# EAGLE design rev_a (EAGLE 7.7.0)
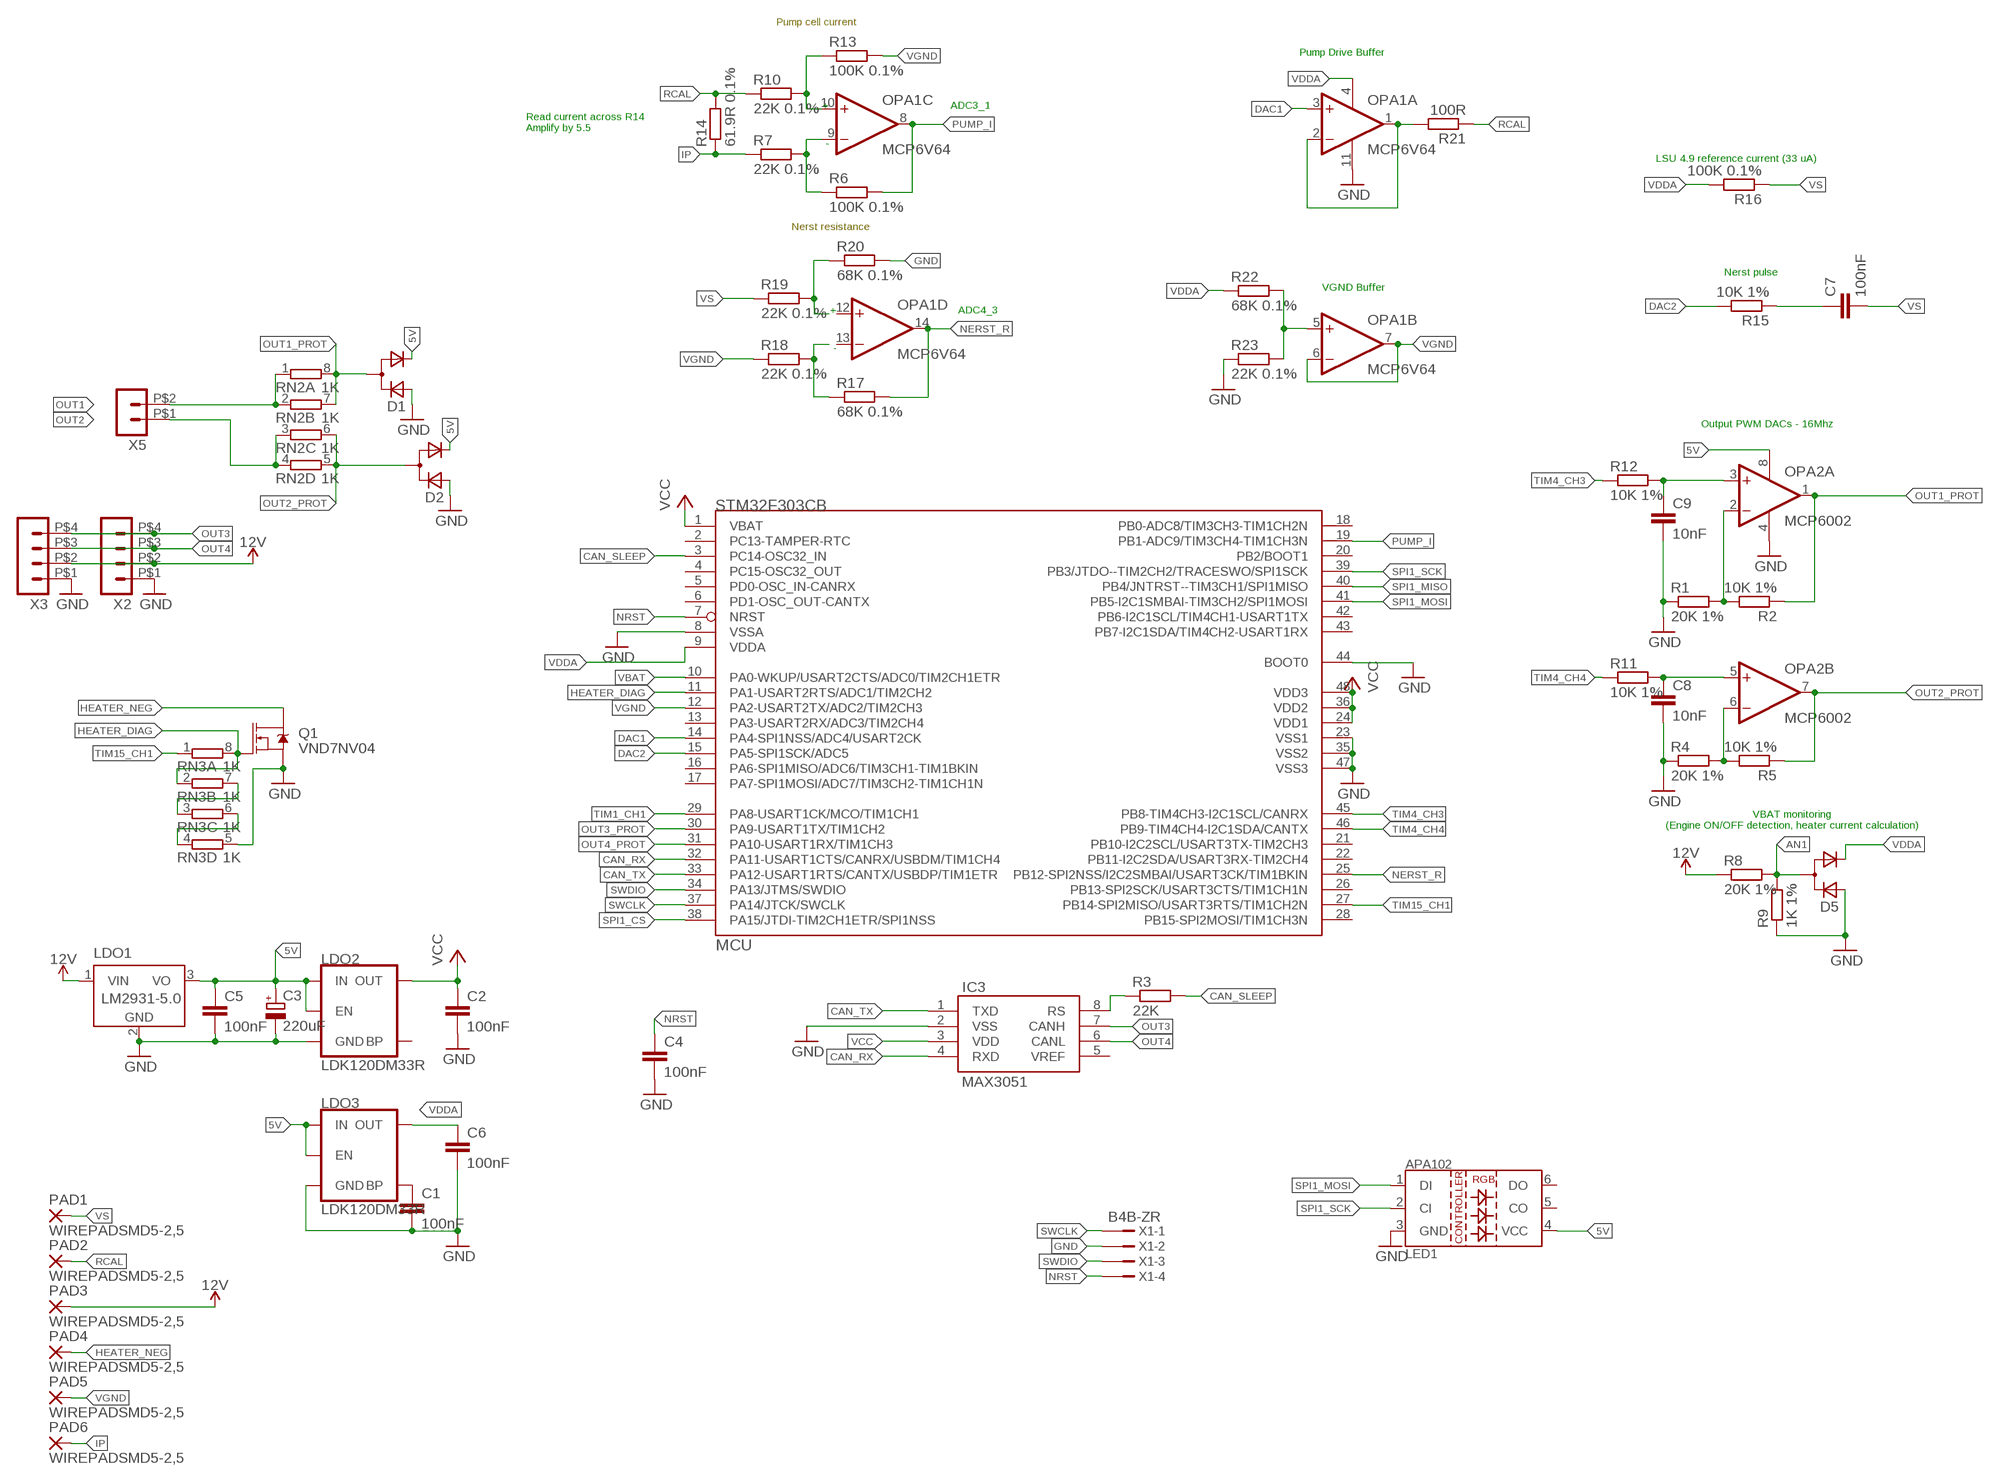
[diagram p0: schematic, sheet 1]

## Parts
C1  100nF  C-EUC0603  [C0603]
C2  100nF  C-EUC0603  [C0603]
C3  220uF  CPOL-EUE2.5-5  [E2,5-5]
C4  100nF  C-EUC0603  [C0603]
C5  100nF  C-EUC0603  [C0603]
C6  100nF  C-EUC0603  [C0603]
C7  100nF  C-EUC0603  [C0603]
C8  10nF  C-EUC0603  [C0603]
C9  10nF  C-EUC0603  [C0603]
D1  D_ACACSOT323  [SOT323]
D2  D_ACACSOT323  [SOT323]
D5  D_ACACSOT323  [SOT323]
IC3  MAX3051  MCP2551  [SO08]
LDO1  LM2931-5.0  LM2936DT-5.0  [TO252]
LDO2  LDK120DM33R  V_REG_MIC52053.3V  [SOT23-5]
LDO3  LDK120DM33R  V_REG_MIC52053.3V  [SOT23-5]
LED1  LED-APA102  [LED-APA102]
MCU  STM32F303CB  STM32-M-48  [LQFP48]
OPA1  MCP6V64  MCP604ST  [TSSOP14]
OPA2  MCP6002  MCP602ST  [TSSOP8]
PAD1  WIREPADSMD5-2,5  [5-2,5]
PAD2  WIREPADSMD5-2,5  [5-2,5]
PAD3  WIREPADSMD5-2,5  [5-2,5]
PAD4  WIREPADSMD5-2,5  [5-2,5]
PAD5  WIREPADSMD5-2,5  [5-2,5]
PAD6  WIREPADSMD5-2,5  [5-2,5]
Q1  VND7NV04  MOSFET-NCH-FDD8780  [DPAK]
R1  20K 1%  R-EU_R0603  [R0603]
R2  10K 1%  R-EU_R0603  [R0603]
R3  22K  R-EU_R0603  [R0603]
R4  20K 1%  R-EU_R0603  [R0603]
R5  10K 1%  R-EU_R0603  [R0603]
R6  100K 0.1%  R-EU_R0603  [R0603]
R7  22K 0.1%  R-EU_R0603  [R0603]
R8  20K 1%  R-EU_R0603  [R0603]
R9  1K 1%  R-EU_R0603  [R0603]
R10  22K 0.1%  R-EU_R0603  [R0603]
R11  10K 1%  R-EU_R0603  [R0603]
R12  10K 1%  R-EU_R0603  [R0603]
R13  100K 0.1%  R-EU_R0603  [R0603]
R14  61.9R 0.1%  R-EU_R0603  [R0603]
R15  10K 1%  R-EU_R0603  [R0603]
R16  100K 0.1%  R-EU_R0603  [R0603]
R17  68K 0.1%  R-EU_R0603  [R0603]
R18  22K 0.1%  R-EU_R0603  [R0603]
R19  22K 0.1%  R-EU_R0603  [R0603]
R20  68K 0.1%  R-EU_R0603  [R0603]
R21  100R  R-EU_R0603  [R0603]
R22  68K 0.1%  R-EU_R0603  [R0603]
R23  22K 0.1%  R-EU_R0603  [R0603]
RN2  1K  4R-N0603-ARC  [0603-ARC]
RN3  1K  4R-N0603-ARC  [0603-ARC]
X1  B4B-ZR  [B4B-ZR]
X2  HEADER_POS4_43045-0401  [43045-0400]
X3  HEADER_POS4_43045-0401  [43045-0400]
X5  HEADER_POS2_43045-0200  [43045-0200]

## Nets
5V: C3.+ C5.1 D1.2(C) D2.2(C) LDO1.3(VO) LDO2.1(IN) LDO2.3(EN) LDO3.1(IN) LDO3.3(EN) LED1.4(VCC) OPA2.8(P:V+)
12V: LDO1.1(VIN) PAD3.1(P) R8.1 X2.P$2 X3.P$2
AN1: D5.1(CA) R8.2 R9.2
CAN_RX: IC3.4(RXD) MCU.32(PA11-USART1CTS/CANRX/USBDM/TIM1CH4)
CAN_SLEEP: MCU.3(PC14-OSC32_IN) R3.2
CAN_TX: IC3.1(TXD) MCU.33(PA12-USART1RTS/CANTX/USBDP/TIM1ETR)
DAC1: MCU.14(PA4-SPI1NSS/ADC4/USART2CK) OPA1.3(A:+IN)
DAC2: MCU.15(PA5-SPI1SCK/ADC5) R15.2
GND: C1.2 C2.2 C3.- C4.2 C5.2 C6.2 C8.2 C9.2 D1.3(A) D2.3(A) D5.3(A) IC3.2(VSS) LDO1.2(GND) LDO2.2(GND) LDO3.2(GND) LED1.3(GND) MCU.23(VSS1) MCU.35(VSS2) MCU.44(BOOT0) MCU.47(VSS3) OPA1.11(P:V-) OPA2.4(P:V-) Q1.3(S) R1.1 R4.1 R9.1 R20.2 R23.1 RN3.5 X1.2 X2.P$1 X3.P$1
HEATER_DIAG: MCU.11(PA1-USART2RTS/ADC1/TIM2CH2) Q1.1(G) RN3.2 RN3.8
HEATER_NEG: PAD4.1(P) Q1.4(D)
IP: PAD6.1(P) R7.1 R14.1
N$2: RN3.3 RN3.7
N$4: C8.1 OPA2.5(B:+IN) R11.2
N$5: OPA2.2(A:-IN) R1.2 R2.2
N$6: OPA2.6(B:-IN) R4.2 R5.2
N$7: RN3.4 RN3.6
N$8: IC3.8(RS) R3.1
N$10: OPA1.5(B:+IN) R22.2 R23.2
N$11: C1.1 LDO3.4(BP)
N$12: C7.1 R15.1
N$13: C9.1 OPA2.3(A:+IN) R12.2
N$15: OPA1.1(A:OUT) OPA1.2(A:-IN) R21.2
NERST_R: MCU.25(PB12-SPI2NSS/I2C2SMBAI/USART3CK/TIM1BKIN) OPA1.14(D:OUT) R17.2
NRST: C4.1 MCU.7(NRST) X1.4
OPA3_IN+: OPA1.10(C:+IN) R10.2 R13.1
OPA3_IN-: OPA1.9(C:-IN) R6.1 R7.2
OPA4_IN+: R19.2 R20.1
OPA4_IN-: R17.1 R18.2
OUT1: RN2.1 RN2.2 X5.P$2
OUT1_PROT: D1.1(CA) OPA2.1(A:OUT) R2.1 RN2.7 RN2.8
OUT2: RN2.3 RN2.4 X5.P$1
OUT2_PROT: D2.1(CA) OPA2.7(B:OUT) R5.1 RN2.5 RN2.6
OUT3: IC3.7(CANH) X2.P$4 X3.P$4
OUT3_PROT: MCU.30(PA9-USART1TX/TIM1CH2)
OUT4: IC3.6(CANL) X2.P$3 X3.P$3
OUT4_PROT: MCU.31(PA10-USART1RX/TIM1CH3)
PUMP_I: MCU.19(PB1-ADC9/TIM3CH4-TIM1CH3N) OPA1.8(C:OUT) R6.2
RCAL: PAD2.1(P) R10.1 R14.2 R21.1
SPI1_CS: MCU.38(PA15/JTDI-TIM2CH1ETR/SPI1NSS)
SPI1_MISO: MCU.40(PB4/JNTRST--TIM3CH1/SPI1MISO)
SPI1_MOSI: LED1.1(DI) MCU.41(PB5-I2C1SMBAI-TIM3CH2/SPI1MOSI)
SPI1_SCK: LED1.2(CI) MCU.39(PB3/JTDO--TIM2CH2/TRACESWO/SPI1SCK)
SWCLK: MCU.37(PA14/JTCK/SWCLK) X1.1
SWDIO: MCU.34(PA13/JTMS/SWDIO) X1.3
TIM1_CH1: MCU.29(PA8-USART1CK/MCO/TIM1CH1)
TIM4_CH3: MCU.45(PB8-TIM4CH3-I2C1SCL/CANRX) R12.1
TIM4_CH4: MCU.46(PB9-TIM4CH4-I2C1SDA/CANTX) R11.1
TIM15_CH1: MCU.27(PB14-SPI2MISO/USART3RTS/TIM1CH2N) RN3.1
VBAT: MCU.1(VBAT) MCU.10(PA0-WKUP/USART2CTS/ADC0/TIM2CH1ETR) ; supply symbol labelled VCC
VCC: C2.1 IC3.3(VDD) LDO2.5(OUT) MCU.24(VDD1) MCU.36(VDD2) MCU.48(VDD3)
VDDA: C6.1 D5.2(C) LDO3.5(OUT) MCU.9(VDDA) OPA1.4(P:V+) R16.2
VGND: MCU.12(PA2-USART2TX/ADC2/TIM2CH3) OPA1.6(B:-IN) OPA1.7(B:OUT) PAD5.1(P) R13.2 R18.1
VS: C7.2 PAD1.1(P) R16.1 R19.1
VSSA: MCU.8(VSSA) ; supply symbol labelled GND
Unconnected: IC3.5(VREF) LDO2.4(BP) LED1.5(CO) LED1.6(DO) MCU.2(PC13-TAMPER-RTC) MCU.4(PC15-OSC32_OUT) MCU.5(PD0-OSC_IN-CANRX) MCU.6(PD1-OSC_OUT-CANTX) MCU.13(PA3-USART2RX/ADC3/TIM2CH4) MCU.16(PA6-SPI1MISO/ADC6/TIM3CH1-TIM1BKIN) MCU.17(PA7-SPI1MOSI/ADC7/TIM3CH2-TIM1CH1N) MCU.18(PB0-ADC8/TIM3CH3-TIM1CH2N) MCU.20(PB2/BOOT1) MCU.21(PB10-I2C2SCL/USART3TX-TIM2CH3) MCU.22(PB11-I2C2SDA/USART3RX-TIM2CH4) MCU.26(PB13-SPI2SCK/USART3CTS/TIM1CH1N) MCU.28(PB15-SPI2MOSI/TIM1CH3N) MCU.42(PB6-I2C1SCL/TIM4CH1-USART1TX) MCU.43(PB7-I2C1SDA/TIM4CH2-USART1RX) OPA1.12(D:+IN) OPA1.13(D:-IN) R22.1

## Notes on the sheet
- Pump cell current
- Pump Drive Buffer
- + | ADC3_1
- Read current across R14
  Amplify by 5.5
- -
- LSU 4.9 reference current (33 uA)
- Nerst resistance
- Nerst pulse
- VGND Buffer
- + | ADC4_3
- -
- Output PWM DACs - 16Mhz
- VBAT monitoring
  (Engine ON/OFF detection, heater current calculation)

## Library data of the parts
C1 C2 C4-C9 = resistor:C-EU: CAPACITOR, European symbol
C3 = rcl:CPOL-EU: POLARIZED CAPACITOR, European symbol
D1 D2 D5 = zetex:D_ACAC: Dual DIODE; OC_FARNELL: unknown; OC_NEWARK: unknown
IC3 = SparkFun-IC-Comms:MCP2551: MCP2551 High Speed CAN Transceiver High speed CAN transceiver Datasheet <http://www.sparkfun.com/datasheets/DevTools/Arduino/MCP2551.pdf> SparkFun Products CAN-BUS Shield <https://www.sparkfun.com/products/13262> (DEV-13262) SparkFun OBD-II UART <https://www.sparkfun.com/products/9555> (WIG-09555); PROD_ID: IC-09907; VALUE: MCP2551
LDO1 = national-semiconductor:LM2936?*: Ultra-Low Quiescent Current LDO Voltage Regulator Source: Data sheet <http://www.national.com/ds/LM/LM2936.pdf>; MF: NATIONAL SEMICONDUCTOR; MPN: LM2936DT-5.0/NOPB; OC_FARNELL: 1286864; OC_NEWARK: 41K4501
LDO2 LDO3 = SparkFun-IC-Power:V_REG_MIC5205: V_REG MIC5205 Standard 3.3V, 5V, and Adjustable 150mA LDO voltage regulator in SOT-23 layout. Micrel part MIC5205. BP (by-pass) pin is used to lower output noise with 470pF cap, may be left open. On the adjustable version BP is used to set output.; PROD_ID: VREG-00822; VALUE: 3.3V/150mA
LED1 = Ai_LED:LED-APA102
MCU = pel_stm32:STM32-M-48: STM32F103 Medium Density 48pins
OPA1 = linear:MCP604: Quad Op Amp 2.7V to 6.0V Single Supply CMOS Source: http://ww1.microchip.com/downloads/en/DeviceDoc/21314g.pdf
OPA2 = linear:MCP602: Single Op Amp 2.7V to 6.0V Single Supply CMOS Source: http://ww1.microchip.com/downloads/en/DeviceDoc/21314g.pdf
PAD1-PAD6 = wirepad:WIREPAD: Wire PAD connect wire on PCB
Q1 = SparkFun-DiscreteSemi:MOSFET-NCH: N-channel MOSFETs Voltage controlled devices that allow control of high current outputs. SparkFun Products: SparkFun OpenScale <https://www.sparkfun.com/products/13261> SparkFun Digital Sandbox <https://www.sparkfun.com/products/12651> SparkFun Monster Moto Shield <https://www.sparkfun.com/products/10182> SparkFun MOSFET Power Controller <https://www.sparkfun.com/products/11214>; PROD_ID: TRANS-09984; VALUE: 35A/25V/8.5mΩ
R1-R23 = resistor:R-EU_: RESISTOR, European symbol
RN2 RN3 = resistor-dil:4R-N: Array Chip Resistor Source: RS Component / Phycomp; OC_FARNELL: unknown; OC_NEWARK: unknown
X1 = con-jst:?4B-ZR: ZH CONNECTOR 1.5 mm, 4 pin 1 row Source: http://www.jst.com .. eZH.pdf; MF: FARNELL; MPN: B4B-ZR(LF)(SN); OC_FARNELL: 1830916; OC_NEWARK: 37K9960
X2 X3 = con-molex-micro-fit-3_0:HEADER_POS4_?: Molex - Micro-Fit 3.0 Series connector, 3.00mm (0.118") pitch header, 4 positions.
X5 = con-molex-micro-fit-3_0:HEADER_POS2_?: Molex - Micro-Fit 3.0 Series connector, 3.00mm (0.118") pitch header, 2 positions.

## Board
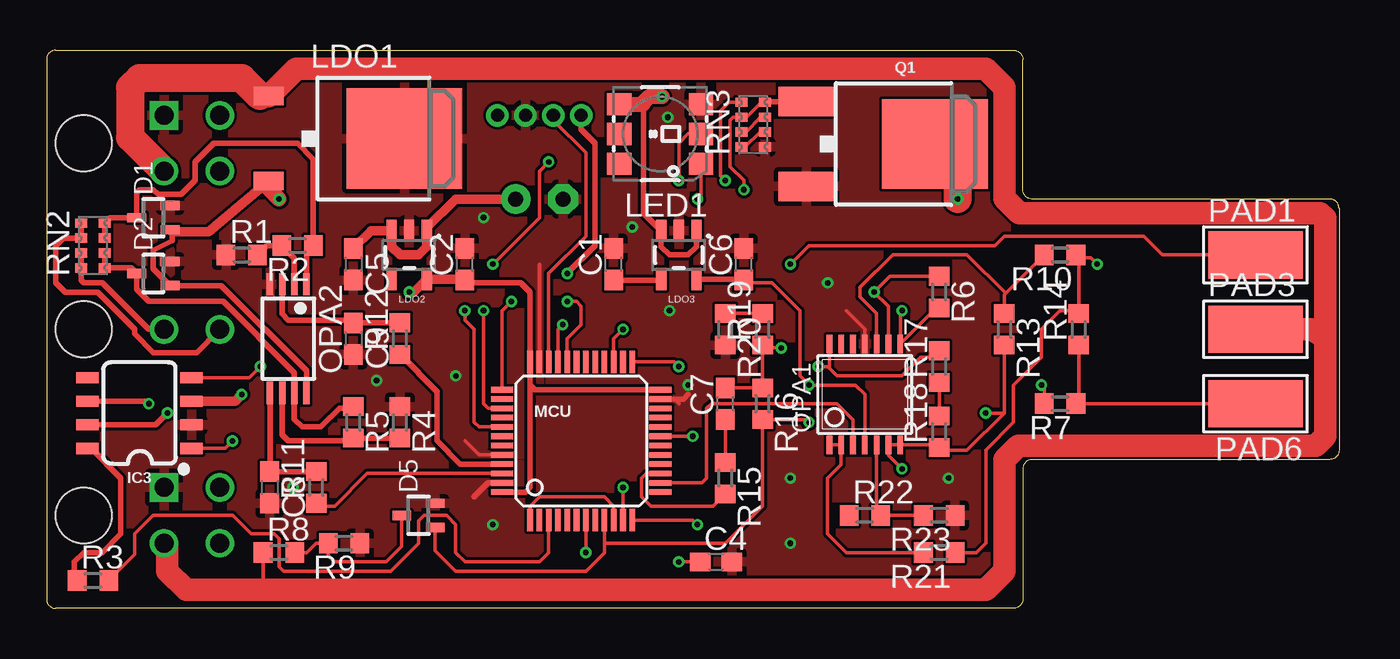
[diagram p1: board, top side]
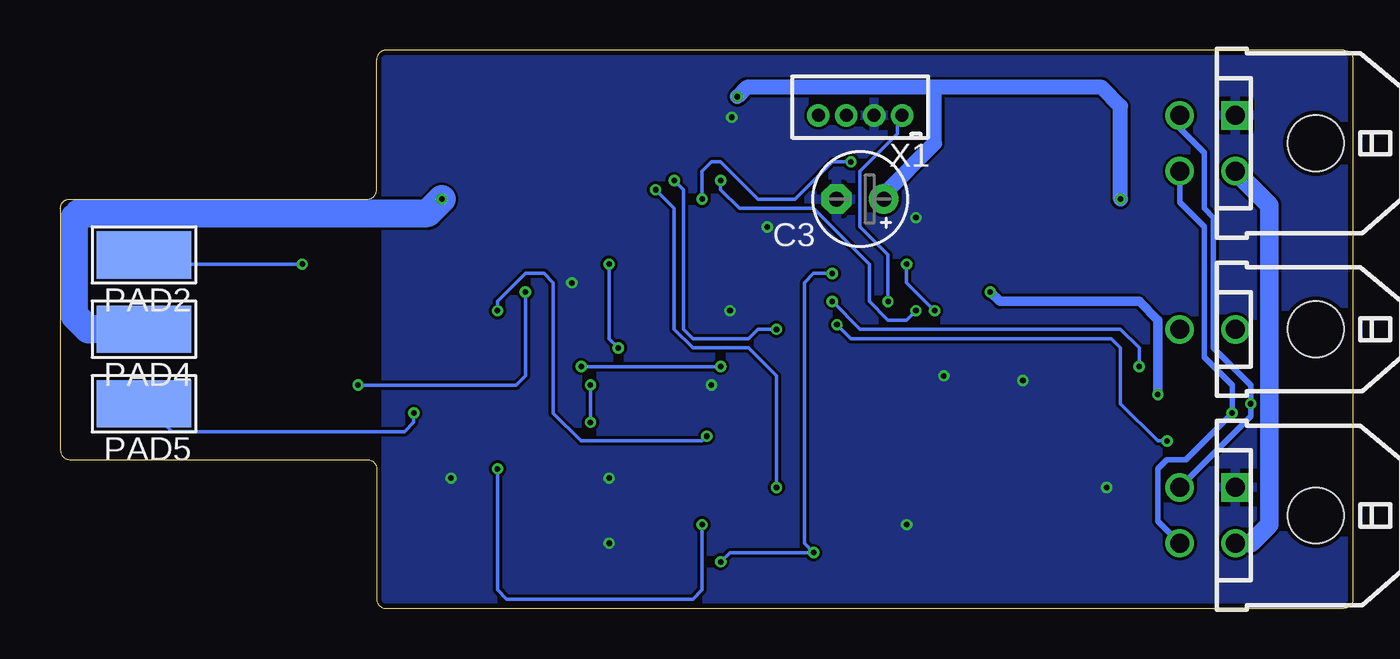
[diagram p2: board, bottom side, seen from below]

Size 69.5 x 30 mm. Coordinates in mm from the lower left corner, seen from the top.
Outline: 0,29.5 0,0.5 arc90 0.5,0 52,0 arc90 52.5,0.5 52.5,7.5 arc-90 53,8 69,8 arc90 69.5,8.5 69.5,21.5 arc90 69,22 53,22 arc-90 52.5,22.5 52.5,29.5 arc90 52,30 0.5,30 arc90 0,29.5
Copper layers (1*16): Top 0.035mm / dielectric 1.5mm / Bottom 0.035mm
Design rules "SeeedStudio_2layer_DRU_no_angle_20140221 *": minimum track width 6mil, minimum drill 0.3mm, track to track 6mil, track to pad 6mil, pad to pad 6mil, via to via 6mil, smd to smd 0mil, copper to edge 10mil, drill to drill 10mil, minimum pad ring 10mil, minimum via ring 6mil, stop-mask expansion 2mil, vias tented up to drill 100mil, thermal gap 10mil

### Footprints (pad centres in the part's own frame; a part is rotated, then mirrored left to right if it is on the bottom)
C0603 = smd 1.1 x 1: 1 -0.85,0; 2 0.85,0
E2,5-5 = drill 0.813 pad 1.6: + -1.27,0 | drill 0.813 pad 1.6 octagon: - 1.27,0
SOT323 = smd 0.5 x 1: 1 0,0.9; 2 -0.65,-0.9; 3 0.65,-0.9
SO08 = smd 0.6 x 1.2: 1 -1.905,-2.8; 2 -0.635,-2.8; 3 0.635,-2.8; 4 1.905,-2.8; 5 1.905,2.8; 6 0.635,2.8; 7 -0.635,2.8; 8 -1.905,2.8
TO252 = smd 1 x 1.6: 1 -2.28,-4.8; 3 2.28,-4.8 | smd 5.4 x 6.2: 2 0,2.5
SOT23-5 = smd 0.55 x 1.2: 1 -0.95,-1.3; 2 0,-1.3; 3 0.95,-1.3; 4 0.95,1.3; 5 -0.95,1.3
LED-APA102 = smd 1.3 x 1.2: 1 -2.2,1.6; 2 -2.2,0; 3 -2.2,-1.6; 4 2.2,-1.6; 5 2.2,0; 6 2.2,1.6
LQFP48 = smd 0.3 x 1.2: 1 -2.75,-4.25; 2 -2.25,-4.25; 3 -1.75,-4.25; 4 -1.25,-4.25; 5 -0.75,-4.25; 6 -0.25,-4.25; 7 0.25,-4.25; 8 0.75,-4.25; 9 1.25,-4.25; 10 1.75,-4.25; 11 2.25,-4.25; 12 2.75,-4.25; 25 2.75,4.25; 26 2.25,4.25; 27 1.75,4.25; 28 1.25,4.25; 29 0.75,4.25; 30 0.25,4.25; 31 -0.25,4.25; 32 -0.75,4.25; 33 -1.25,4.25; 34 -1.75,4.25; 35 -2.25,4.25; 36 -2.75,4.25 | smd 1.2 x 0.3: 13 4.25,-2.75; 14 4.25,-2.25; 15 4.25,-1.75; 16 4.25,-1.25; 17 4.25,-0.75; 18 4.25,-0.25; 19 4.25,0.25; 20 4.25,0.75; 21 4.25,1.25; 22 4.25,1.75; 23 4.25,2.25; 24 4.25,2.75; 37 -4.25,2.75; 38 -4.25,2.25; 39 -4.25,1.75; 40 -4.25,1.25; 41 -4.25,0.75; 42 -4.25,0.25; 43 -4.25,-0.25; 44 -4.25,-0.75; 45 -4.25,-1.25; 46 -4.25,-1.75; 47 -4.25,-2.25; 48 -4.25,-2.75
TSSOP14 = smd 0.305 x 0.991: 1 -1.905,-2.718; 2 -1.27,-2.718; 3 -0.635,-2.718; 4 0,-2.718; 5 0.635,-2.718; 6 1.27,-2.718; 7 1.905,-2.718; 8 1.905,2.718; 9 1.27,2.718; 10 0.635,2.718; 11 0,2.718; 12 -0.635,2.718; 13 -1.27,2.718; 14 -1.905,2.718
TSSOP8 = smd 0.35 x 1.2: 1 -0.975,-2.925; 2 -0.325,-2.925; 3 0.325,-2.925; 4 0.975,-2.925; 5 0.975,2.925; 6 0.325,2.925; 7 -0.325,2.925; 8 -0.975,2.925
5-2,5 = smd 2.54 x 5.08: 1 0,0
DPAK = smd 1.6 x 3: 1 -2.28,-5.31; 3 2.28,-5.31 | smd 4.826 x 5.715: 4 0,1.588
R0603 = smd 1 x 1.1: 1 -0.85,0; 2 0.85,0
0603-ARC = smd 0.5 x 0.65: 1 -1.2,-0.625; 2 -0.4,-0.625; 3 0.4,-0.625; 4 1.2,-0.625; 5 1.2,0.625; 6 0.4,0.625; 7 -0.4,0.625; 8 -1.2,0.625
B4B-ZR = drill 0.7 pad 1.1: 1 -2.25,0; 2 -0.75,0; 3 0.75,0; 4 2.25,0
43045-0400 = drill 1.02 square: P$1 1.5,4.32 | drill 1.02: P$2 -1.5,4.32; P$3 1.5,7.32; P$4 -1.5,7.32 | hole 3: 0,0
43045-0200 = drill 1.02: P$1 0,4.32; P$2 0,7.32 | hole 3: 0,0

### Placement (x,y rotation side)
C1  30.5,18.5 90 top
C2  22.5,18.5 90 top
C3  26.5,22 180 bottom
C4  36,2.5 0 top
C5  16.5,18.5 270 top
C6  37.5,18.5 90 top
C7  36.5,11 90 top
C8  12,6.5 270 top
C9  16.5,14.5 270 top
D1  5.75,21 90 top
D2  5.75,18 90 top
D5  20,5 90 top
IC3  5,10.5 90 top
LDO1  16.75,25.25 270 top
LDO2  19.5,19 180 top
LDO3  34,19 180 top
LED1  33,25.5 180 top
MCU  28.75,9 0 top
OPA1  44,11.5 0 top
OPA2  13,14.5 180 top
PAD1  65,19 270 top
PAD2  65,19 90 bottom
PAD3  65,15 270 top
PAD4  65,15 90 bottom
PAD5  65,11 90 bottom
PAD6  65,11 90 top
Q1  46.18,24.96 270 top
R1  10.5,19 0 top
R2  13.5,19.5 180 top
R3  2.5,1.5 0 top
R4  19,10 270 top
R5  16.5,10 270 top
R6  48,17 270 top
R7  54.5,11 180 top
R8  12.5,3 0 top
R9  16,3.5 180 top
R10  54.5,19 180 top
R11  14.5,6.5 90 top
R12  19,14.5 90 top
R13  51.5,15 270 top
R14  55.5,15 90 top
R15  36.5,7 270 top
R16  38.5,11 270 top
R17  48,13 90 top
R18  48,9.5 90 top
R19  38.5,15 90 top
R20  36.5,15 270 top
R21  48,3 180 top
R22  44,5 0 top
R23  48,5 180 top
RN2  2.5,19.5 270 top
RN3  38,26 270 top
X1  26.5,26.5 180 bottom
X2  2,5 90 bottom
X3  2,25 90 bottom
X5  2,15 90 bottom

### Tracks (layer width: path | path; a pad name or v marks a point on that pad's centre or on a via)
5V  (via drill 0.3)
  Top 0.3: D1.2 6.75,20.25 6.75,19.75 5.75,19.25 5.75,18.25 D2.2 9.4,17.35 13.97,12.78 OPA2.8 | LDO3.1 34.95,19.45 34.5,19 33.5,19 33.05,19.45 LDO3.3 32.1,21.25 32.1,27.1
  Top 0.5: 6.75,20.25 8.73,20.25 LDO1.3 | C5.1 17.45,20.3 LDO2.3 18.55,19.45 19,19 20,19 20.45,19.45 LDO2.1 20.45,20.45 22,22 C3.+
  Top 0.8: LDO1.3 11.95,22.55 v12.5,22 | LED1.4 32,27.1 | 32,27.1 32.1,27.1 | v33.1,27.5 32.4,27.5 32,27.1
  Bottom 0.8: v12.5,22 12.5,27 13.5,28 22.5,28 | 22.5,28 32.6,28 v33.1,27.5 | C3.+ 25.23,22.27 22.5,25 22.5,28
12V
  Top 0.2: R8.1 11.65,1.15 12,1
  Top 0.8: LDO1.1 11.47,27.53
  Top 1.2: LDO1.1 13.42,29 50.5,29 51.5,28 51.5,22.05 52.3,21.25 68.5,21.25 68.75,21 68.75,14.5 | PAD3.1 68,15 68.75,14.5 | 68.75,14.5 68.75,9.25 68.25,8.75 52.25,8.75 51.5,8 51.5,2 50.5,1 12,1 7.5,1 6.5,2 6.5,3.32 X2.P$2
  Top 1.5: X3.P$2 4.5,25.32 4.5,28 5,28.5 10.5,28.5 11.47,27.53
  Bottom 1: X2.P$2 5.5,3.5 4.5,4.5 4.5,21.68 X3.P$2
AN1
  Top 0.2: R8.2 14,3 14.5,3.5 R9.2 15.15,2.85 15.5,2.5 18.25,2.5 19.1,3.35 D5.1
CAN_RX  (via drill 0.3)
  Top 0.2: IC3.4 10.9,12.4 v11.5,13 | MCU.32 28,14.5 28.75,15.25 28.75,16.25 28.5,16.5 v28,16.5
  Bottom 0.2: v11.5,13 11.5,14 12.5,15 26.5,15 v28,16.5
CAN_SLEEP
  Top 0.2: MCU.3 27,3 26.5,2.5 22.5,2.5 22,3 22,4.5 21.5,5 20.3,5 20,4.7 20,3.5 18.5,2 12.75,2 12.5,2.25 12.5,3.75 12.25,4 11,4 10,5 5.75,5 4.75,4 4.75,2.9 R3.2
CAN_TX  (via drill 0.3)
  Top 0.2: IC3.1 9.6,8.6 v10,9 | MCU.33 27.5,15 v27.75,15.25
  Bottom 0.2: v10,9 10.5,9 12.5,11 12.5,14 13,14.5 27,14.5 v27.75,15.25
DAC1
  Top 0.2: MCU.14 35.25,6.75 35.5,7 35.5,10.75 35.75,11 42.5,11 43.37,10.13 OPA1.3
DAC2
  Top 0.2: MCU.15 32.25,7.25 32,7 32,6 32.5,5.5 35.85,5.5 R15.2
GND  (via drill 0.3)
  Top 0.2: MCU.23 33.75,11.25 34,11 | OPA1.11 44,15 43,16 | MCU.35 26.5,18.5 | MCU.44 23.25,8.25 22.5,9
  Top 0.3: MCU.47 23.75,6.75 23,6 | 33.75,11.25 34.25,11.25 34.5,11.5
  other vias: 24,4.5 22,12.5 40,3.5 31.5,20.5 17.75,12.25 13.25,6.5 33.4,26.4 42,17.5 33.5,16 48.5,7 40,7 23.5,21 34.5,12
  pour Top: 0,30 52,30 52,0 0,0
  pour Bottom: 0,30 52,30 52,0 0,0
HEATER_DIAG  (via drill 0.3)
  Top 0.2: RN3.8 38.45,27.2 37.65,26.4 RN3.2 36.9,26.4 36.75,26.25 36.75,23.75 37.5,23 v37.5,22.5 | MCU.11 v31,6.5
  Top 0.3: Q1.1 38.66,27.24 RN3.8
  Bottom 0.2: v31,6.5 31,12.5 32.5,14 35.5,14 36.5,15 36.5,21.5 v37.5,22.5
HEATER_NEG  (via drill 0.3)
  Top 0.8: 49,25.93 Q1.4
  Top 1.5: v49,22 49,25.93
  Bottom 0.8: 68.75,21 68.5,21.25
  Bottom 1.5: PAD4.1 68,15 68.75,15.75 68.75,21 | 68.5,21.25 49.75,21.25 v49,22
IP
  Top 0.2: PAD6.1 R7.1 55.5,11.15 R14.1
N$2
  Top 0.2: RN3.3 37.6,25.6 38.4,26.4 RN3.7
N$4
  Top 0.3: OPA2.5 12.03,7.38 C8.1 R11.2
N$5
  Top 0.3: OPA2.2 13.32,18.82 R2.2 11.85,19.5 R1.2
N$6
  Top 0.3: OPA2.6 12.68,9.32 13,9 16.35,9 R5.2 R4.2
N$7
  Top 0.2: RN3.4 37.55,24.8 38.35,25.6 RN3.6
N$8
  Top 0.3: IC3.8 2.4,8.6 4,7 4,4 3,3 2,3 1.5,2.5 1.5,1.65 R3.1
N$10
  Top 0.2: R23.2 R22.2 44.63,5.21 OPA1.5
N$11
  Top 0.3: C1.1 33,17.65 LDO3.4
N$12
  Top 0.2: R15.1 C7.1
N$13
  Top 0.3: OPA2.3 12.68,15.82 13,15.5 16.35,15.5 C9.1 R12.2
N$15
  Top 0.2: OPA1.1 OPA1.2 42.73,7.73 42,7 42,4 43,3 R21.2
NERST_R  (via drill 0.3)
  Top 0.2: OPA1.14 42.09,12.9 | 42.09,12.9 42.5,12.5 46,12.5 47,13.5 47.65,13.5 R17.2 | MCU.25 33.75,13.25 v34,13 | v41.5,13 42,13 42.09,12.9
  Bottom 0.2: v34,13 v41.5,13
NRST  (via drill 0.3)
  Top 0.2: MCU.7 v29,3 | v34,2.5 C4.1
  Top 0.3: X1.4 28.75,25.75 29.5,25 29.5,19.5 v28,18
  Bottom 0.2: v28,18 29,18 29.5,17.5 29.5,3.5 v29,3 33.5,3 v34,2.5
OPA3_IN+
  Top 0.2: R13.1 51.5,16.85 51.58,16.93 | 51.58,16.93 R10.2 | OPA1.10 44.63,15.87 43.75,16.75 43.75,17.25 45.5,19 49.5,19 51.58,16.93
OPA3_IN-  (via drill 0.3)
  Top 0.2: R7.2 53.65,11.85 v53.5,12 | R6.1 45.35,17.85 v44.5,17 45.27,16.23 OPA1.9
  Bottom 0.2: v53.5,12 45,12 44.5,12.5 v44.5,17
OPA4_IN+
  Top 0.2: R20.1 R19.2
OPA4_IN-
  Top 0.2: R17.1 R18.2
OUT1
  Top 0.3: RN2.1 RN2.2 0.9,19.9 0.5,19.5 0.5,17.5 1,17 2.75,17 4.75,15 4.75,14.75 5.75,13.75 8.07,13.75 X5.P$2
OUT1_PROT
  Top 0.3: RN2.7 RN2.8 3.42,21 D1.1 4.85,22.35 5,22.5 5.75,22.5 6,22.25 7.25,22.25 8,23 8,24 9,25 13.5,25 14.35,24.15 R2.1 13.97,19.12 OPA2.1
OUT2
  Top 0.3: RN2.3 RN2.4 1.88,17.62 2,17.5 3,17.5 5.5,15 X5.P$1
OUT2_PROT
  Top 0.3: RN2.6 RN2.5 4.55,18.3 D2.1 4.85,17.15 5.5,16.5 9.5,16.5 13.32,12.68 OPA2.7 13.32,10.18 13.75,9.75 14.75,9.75 15.75,10.75 16.4,10.75 R5.1
OUT3  (via drill 0.3)
  Top 0.3: IC3.7 5.87,9.87 v6.5,10.5
  Bottom 0.3: X3.P$4 9.32,21.82 8,20.5 8,13.5 6.5,12 v6.5,10.5 9,8 10,8 10.5,7.5 10.5,4.68 X2.P$4
OUT4  (via drill 0.3)
  Top 0.3: IC3.6 5.37,11.13 v5.5,11
  Bottom 0.3: X3.P$3 9.32,25.82 8,24.5 8,21.5 7.5,21 7.5,14 5.5,12 v5.5,11 5.5,10.32 X2.P$3
PUMP_I  (via drill 0.3)
  Top 0.2: R6.2 47.84,16.15 OPA1.8 45.91,15.9 v46,16 | v34.75,9.25 MCU.19
  Bottom 0.2: v46,16 46,16.5 44.5,18 43.5,18 43,17.5 43,10.5 41.5,9 35,9 v34.75,9.25
RCAL  (via drill 0.3)
  Top 0.2: R21.1 50,3 50.5,3.5 50.5,8.5 52,10 52,12 53.5,13.5 53.5,15 54.5,16 55.35,16 R14.2 55.5,18.85 | 55.5,18.85 R10.1 | 55.5,18.85 56.15,18.85 v56.5,18.5
  Bottom 0.2: 64.5,19.5 PAD2.1 64.5,18.5 v56.5,18.5
SPI1_MOSI  (via drill 0.3)
  Top 0.2: LED1.1 35.2,22.2 v35,22 | v27,24 26.5,23.5 26.5,21 v24,18.5 | v22.5,16 22.5,15.5 23,15 23,10 23.25,9.75 MCU.41
  Bottom 0.2: v35,22 35,23.5 34.5,24 34,24 32,22 30,22 28,24 v27,24 | v24,18.5 24,17.5 v22.5,16
SPI1_SCK  (via drill 0.3)
  Top 0.2: LED1.2 34.5,25.5 34,25 v34,23 | v23.5,16 23.5,11 23.75,10.75 MCU.39
  Bottom 0.2: v34,23 34,22.5 33,21.5 29,21.5 26,18.5 26,16.5 25,15.5 24,15.5 v23.5,16
SWCLK  (via drill 0.3)
  Top 0.2: MCU.37 24.5,16 v25,16.5
  Bottom 0.2: v25,16.5 25,19 26.5,20.5 26.5,23.5 24.5,25.5 24.5,26.25 X1.1
SWDIO
  Top 0.2: MCU.34 27,18 29,20 29,24.5 27.25,26.25 X1.3
TIM4_CH3
  Top 0.3: MCU.45 22.25,7.75 21,9 21,11.65 R12.1
TIM4_CH4
  Top 0.2: MCU.46 17.25,7.25 15.5,5.5 14.65,5.5 R11.1
TIM15_CH1  (via drill 0.3)
  Top 0.2: RN3.1 36.7,27.2 36.25,26.75 36.25,23.25 v36.5,23 | MCU.27 30.5,14.5 v31,15
  Bottom 0.2: v31,15 32,15 32.5,14.5 35.5,14.5 36,15 36,22.5 v36.5,23
VBAT
  Top 0.2: MCU.1 26,5.5 26.5,6 30,6 30.5,5.5 MCU.10
VCC  (via drill 0.3)
  Top 0.3: MCU.48 25.75,6.25 26,6.5 26,12 | 26,12 MCU.36 26,17 25.5,17.5 22.65,17.5 C2.1 | MCU.24 26.25,11.75 26,12
  Top 0.5: C2.1 22.45,17.7 LDO2.5 19.75,17 v19.5,17 | IC3.3 10.13,11.13 v10.5,11.5
  Bottom 0.5: v10.5,11.5 10.5,15.5 11.5,16.5 19,16.5 v19.5,17
VDDA  (via drill 0.3)
  Top 0.2: MCU.9 30,3.5 | 30,3.5 30,3 29,2 22,2 20.9,3.1 D5.2 | 30,3.5 36.5,3.5 38.5,5.5 R16.2 40.85,10.15 v41,10 | OPA1.4 44,11.5 43.5,12 v41,12 40.5,12.5 40.5,16 39,17.5 37.65,17.5 C6.1
  Top 0.3: LDO3.5 37.45,17.7 C6.1
  Bottom 0.2: v41,10 v41,12
VGND  (via drill 0.3)
  Top 0.2: MCU.12 34.75,4.75 v35,4.5 | v46,7.5 45.27,8.23 OPA1.6 OPA1.7 47.87,8.78 R18.1 48.15,8.5 49.5,8.5 51.5,10.5 | R13.2 51.5,10.5 | 51.5,10.5 v50.5,10.5
  Bottom 0.2: v35,4.5 35,1 35.5,0.5 45.5,0.5 46,1 v46,7.5 | v50.5,10.5 50.5,10 51,9.5 63.5,9.5 PAD5.1
VS  (via drill 0.3)
  Top 0.2: C7.2 R16.1 R19.1 38.65,14 v39.5,14 | PAD1.1 60,19 59,20 51.5,20 51,19.5 41,19.5 v40,18.5
  Bottom 0.2: v40,18.5 40,14.5 v39.5,14